# Altium schematic sheet Merg_project.SchDoc
size A; SheetNumber: 1; SheetTotal: 5
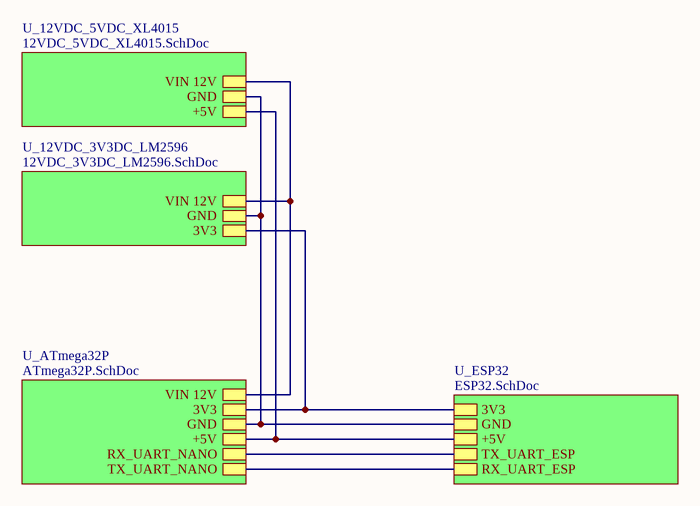
[diagram p0: Merg_project.SchDoc]

## Sub-sheets
U_12VDC_3V3DC_LM2596 = 12VDC_3V3DC_LM2596.SchDoc: 3V3, GND, VIN 12V
U_12VDC_5VDC_XL4015 = 12VDC_5VDC_XL4015.SchDoc: +5V, GND, VIN 12V
U_ATmega32P = ATmega32P.SchDoc: TX_UART_NANO, RX_UART_NANO, +5V, GND, 3V3, VIN 12V
U_ESP32 = ESP32.SchDoc: 3V3, GND, +5V, TX_UART_ESP, RX_UART_ESP

## Nets
(unnamed): sheet U_12VDC_3V3DC_LM2596/3V3, sheet U_ATmega32P/3V3, sheet U_ESP32/3V3
(unnamed): sheet U_12VDC_3V3DC_LM2596/GND, sheet U_12VDC_5VDC_XL4015/GND, sheet U_ATmega32P/GND, sheet U_ESP32/GND
(unnamed): sheet U_12VDC_3V3DC_LM2596/VIN 12V, sheet U_12VDC_5VDC_XL4015/VIN 12V, sheet U_ATmega32P/VIN 12V
(unnamed): sheet U_12VDC_5VDC_XL4015/+5V, sheet U_ATmega32P/+5V, sheet U_ESP32/+5V
(unnamed): sheet U_ATmega32P/TX_UART_NANO, sheet U_ESP32/RX_UART_ESP
(unnamed): sheet U_ATmega32P/RX_UART_NANO, sheet U_ESP32/TX_UART_ESP